# Altium schematic sheet RecoveryBoard_V3.SchDoc
size C; SheetNumber: 1; SheetTotal: 1
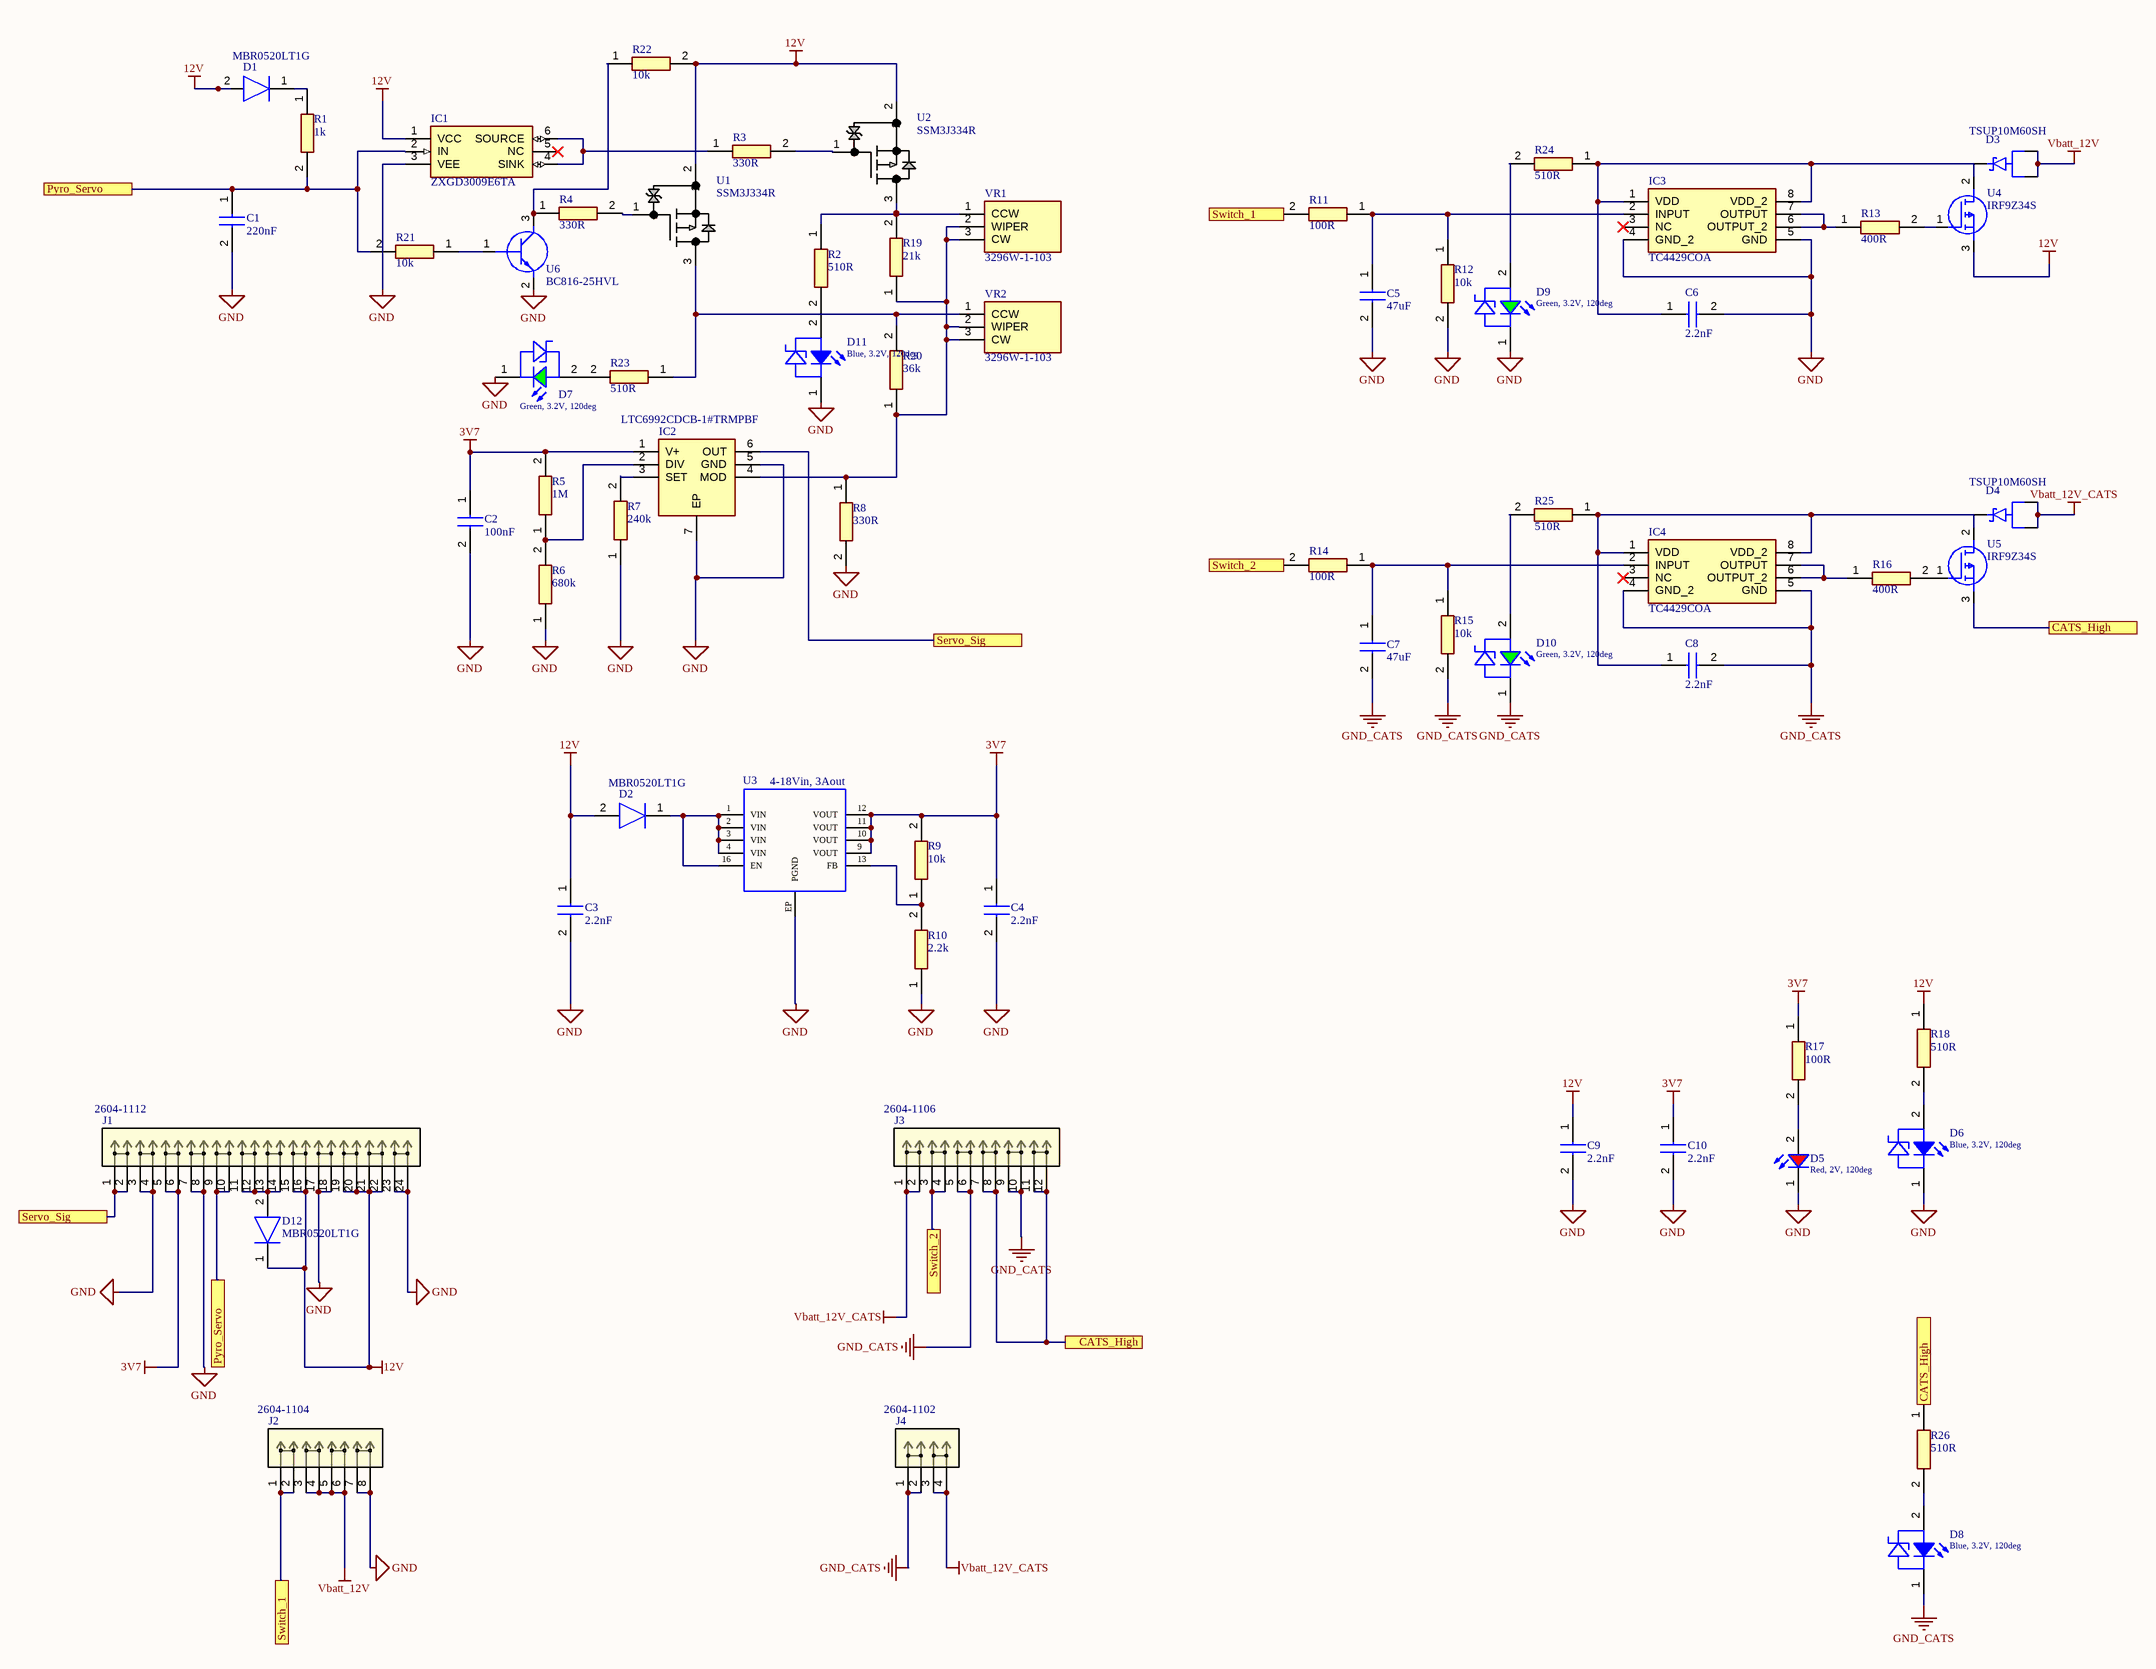
[diagram p0: RecoveryBoard_V3.SchDoc]

## Parts
C1  220nF  [CAPC1608X87N]
C2  100nF  [CAPC1608X87N]
C3  2.2nF  [CAPC1608X87N]
C4  2.2nF  [CAPC1608X87N]
C5  47uF  [CAPC1608X87N]
C6  2.2nF  [CAPC1608X87N]
C7  47uF  [CAPC1608X87N]
C8  2.2nF  [CAPC1608X87N]
C9  2.2nF  [CAPC1608X87N]
C10  2.2nF  [CAPC1608X87N]
D1  MBR0520LT1G  [SOD3716X135N]
D2  MBR0520LT1G  [SOD3716X135N]
D3  TSUP10M60SH  [DIO_TSUP10M60SH]
D4  TSUP10M60SH  [DIO_TSUP10M60SH]
D5  Red, 2V, 120deg  [WL-SMCC_0603_RS_VS_YS]
D6  Blue, 3.2V, 120deg  [WL-SMCC_0603_GS_BS]
D7  Green, 3.2V, 120deg  [WL-SMCC_0603_GS_BS]
D8  Blue, 3.2V, 120deg  [WL-SMCC_0603_GS_BS]
D9  Green, 3.2V, 120deg  [WL-SMCC_0603_GS_BS]
D10  Green, 3.2V, 120deg  [WL-SMCC_0603_GS_BS]
D11  Blue, 3.2V, 120deg  [WL-SMCC_0603_GS_BS]
D12  MBR0520LT1G  [SOD3716X135N]
IC1  ZXGD3009E6TA  [SOT95P285X140-6N]
IC2  LTC6992CDCB-1#TRMPBF  [SON50P300X200X80-7N-D]
IC3  TC4429COA  [SOIC127P600X175-8N]
IC4  TC4429COA  [SOIC127P600X175-8N]
J1  2604-1112  [CONN_2604-1112_24_WAG]
J2  2604-1104  [CONN_2604-1104_8_WAG]
J3  2604-1106  [CONN_2604-1106_12_WAG]
J4  2604-1102  [CONN_2604-1102_4_WAG]
R1  1k  [RESC1608X55N]
R2  510R  [RESC1608X55N]
R3  330R  [RESC1608X55N]
R4  330R  [RESC1608X55N]
R5  1M  [RESC1608X55N]
R6  680k  [RESC1608X55N]
R7  240k  [RESC1608X55N]
R8  330R  [RESC1608X55N]
R9  10k  [RESC1608X55N]
R10  2.2k  [RESC1608X55N]
R11  100R  [RESC1608X55N]
R12  10k  [RESC1608X55N]
R13  400R  [RESC1608X55N]
R14  100R  [RESC1608X55N]
R15  10k  [RESC1608X55N]
R16  400R  [RESC1608X55N]
R17  100R  [RESC1608X55N]
R18  510R  [RESC1608X55N]
R19  21k  [RESC1608X55N]
R20  36k  [RESC1608X55N]
R21  10k  [RESC1608X55N]
R22  10k  [RESC1608X55N]
R23  510R  [RESC1608X55N]
R24  510R  [RESC1608X55N]
R25  510R  [RESC1608X55N]
R26  510R  [RESC1608X55N]
U1  SSM3J334R  [SOT-23F_TOS]
U2  SSM3J334R  [SOT-23F_TOS]
U3  4-18Vin, 3Aout  [LGA-16EP]
U4  IRF9Z34S  [TO-263(D2PAK)]
U5  IRF9Z34S  [TO-263(D2PAK)]
U6  BC816-25HVL  [SOT95P230X110-3N]
VR1  3296W-1-103  [3296W1103]
VR2  3296W-1-103  [3296W1103]

## Ports
CATS_High, Pyro_Servo, Servo_Sig, Switch_1, Switch_2

## Nets
3V7: C2.1 C4.1 C10.1 IC2.1(V+) J1.5 J1.6 R5.2 R9.2 R17.1 U3.9(VOUT) U3.10(VOUT) U3.11(VOUT) U3.12(VOUT)
12V: C3.1 C9.1 D1.2(A) D2.2(A) D12.1(K) IC1.1(VCC) J1.15 J1.16 J1.19 J1.20 J1.21 J1.22 R18.1 R22.2 U1.2 U2.2 U4.3(G)
GND: C1.2 C2.2 C3.2 C4.2 C5.2 C6.2 C9.2 C10.2 D5.1(K) D6.1(K) D7.1(K) D9.1(K) D11.1(K) IC1.3(VEE) IC2.5(GND) IC2.7(EP) IC3.4(GND_2) IC3.5(GND) J1.3 J1.4 J1.7 J1.8 J1.17 J1.18 J1.23 J1.24 J2.7 J2.8 R6.1 R7.1 R8.2 R10.1 R12.2 U3.EP(PGND) U6.2(E)
GND_CATS: C7.2 C8.2 D8.1(K) D10.1(K) IC4.4(GND_2) IC4.5(GND) J3.5 J3.6 J3.9 J3.10 J4.1 J4.2 R15.2
Vbatt_12V: D3.1(A1) D3.2(A2) J2.3 J2.4 J2.5 J2.6
Vbatt_12V_CATS: D4.1(A1) D4.2(A2) J3.1 J3.2 J4.3 J4.4
CATS_High: J3.7 J3.8 J3.11 J3.12 R26.1 U5.3(G) ; port CATS_High
Pyro_Servo: C1.1 IC1.2(IN) J1.9 J1.10 R1.2 R21.2 ; port Pyro_Servo
Servo_Sig: IC2.6(OUT) J1.1 J1.2 ; port Servo_Sig
Switch_1: J2.1 J2.2 R11.2 ; port Switch_1
Switch_2: J3.3 J3.4 R14.2 ; port Switch_2
NetC5_1: C5.1 IC3.2(INPUT) R11.1 R12.1
NetC6_1: C6.1 D3.3(K) IC3.1(VDD) IC3.8(VDD_2) R24.1 U4.2(D)
NetC7_1: C7.1 IC4.2(INPUT) R14.1 R15.1
NetC8_1: C8.1 D4.3(K) IC4.1(VDD) IC4.8(VDD_2) R25.1 U5.2(D)
NetD1_1: D1.1(K) R1.1
NetD2_1: D2.1(K) U3.1(VIN) U3.2(VIN) U3.3(VIN) U3.4(VIN) U3.16(EN)
NetD5_2: D5.2(A) R17.2
NetD6_2: D6.2(A) R18.2
NetD7_2: D7.2(A) R23.2
NetD8_2: D8.2(A) R26.2
NetD9_2: D9.2(A) R24.2
NetD10_2: D10.2(A) R25.2
NetD11_2: D11.2(A) R2.2
NetD12_2: D12.2(A) J1.11 J1.12 J1.13 J1.14
NetIC1_4: IC1.4(SINK) IC1.6(SOURCE) R3.1
NetIC2_2: IC2.2(DIV) R5.1 R6.2
NetIC2_3: IC2.3(SET) R7.2
NetIC2_4: IC2.4(MOD) R8.1 R19.1 R20.1 VR1.2(WIPER) VR1.3(CW) VR2.2(WIPER) VR2.3(CW)
NetIC3_6: IC3.6(OUTPUT_2) IC3.7(OUTPUT) R13.1
NetIC4_6: IC4.6(OUTPUT_2) IC4.7(OUTPUT) R16.1
NetR2_1: R2.1 R19.2 U2.3 VR1.1(CCW)
NetR3_2: R3.2 U2.1
NetR4_1: R4.1 R22.1 U6.3(C)
NetR4_2: R4.2 U1.1
NetR9_1: R9.1 R10.2 U3.13(FB)
NetR13_2: R13.2 U4.1(G)
NetR16_2: R16.2 U5.1(G)
NetR20_2: R20.2 R23.1 U1.3 VR2.1(CCW)
NetR21_1: R21.1 U6.1(B)

Not connected (* = marked no-connect by the designer): IC1 5(NC)*; IC3 3(NC)*; IC4 3(NC)*

## Notes on the sheet
- DWG. NO.
- REV.
- SHT.
- THIS DOCUMENT AND THE DATA DISCLOSED HEREIN OR HEREWITH IS THE PROPERTY OF ALTIUM LIMITED AND MAY BE FREELY DISTRIBUTED IN WHOLE. NO RIGHTS ARE RESERVED OR EXPRESS OR IMPLIED WARANTEE GIVEN.
- REVISION
- DESCRIPTION
- DATE
- APPROVED
- ENG:
- APPROVALS
- PROJECT
- DSN:
- CHK:
- REFERENCE DOCUMENTS
- PROJECT REVISION:
- TITLE
- DOCUMENT REVISION:
- DESIGN ITEM:
- BOM:
- FAB DWG:
- PCB DWG:
- ASSY DWG:
- SCALE:
- SIZE
- B
- CAGE CODE
- FILE NAME
- DWG NO.
- SHEET
- OF
- REV

## Library data of the parts
C1-C10 = 885012206036: Capacitor; Manufacturer_Name: Wurth Elektronik; Datasheet Link: https://katalog.we-online.com/pbs/datasheet/885012206036.pdf; Height: 0.87mm; Manufacturer_Part_Number: 885012206036
D1 D2 D12 = MBR0520LT1G: Diode; Manufacturer_Name: ON Semiconductor; Datasheet Link: http://www.onsemi.com/pub/Collateral/MBR0520LT1-D.PDF; Height: 1.35mm; Manufacturer_Part_Number: MBR0520LT1G
D5 = 150060RS73220: WL-SMCC SMD Mono-color Chip LED Compact, size 0603, Red, 2V, 120deg; Dominant Wavelength: 624nm; Luminous Intensity: 90mcd; Peak Wavelength: 632nm; Chip Technology: AlInGaP; ComponentLink1URL: http://www.we-online.de; ComponentLink2Description: Datasheet; ComponentLink2URL: https://katalog.we-online.com/led/datasheet/150060RS73220.pdf; Part Number: 150060RS73220; Published Date: July 2019; Publisher: Wurth Elektronik; Size: 0603; Viewing Angle: 120deg; Packaging: Tape and Reel; Emitting Color: Red; Mounting Technology: SMT; Forward Voltage: 2V; Operating Temperature: -40 to +85degC
D6 D8 D11 = 150060BS73220: WL-SMCC SMD Mono-color Chip LED Compact, size 0603, Blue, 3.2V, 120deg; Dominant Wavelength: 470nm; Luminous Intensity: 170mcd; Peak Wavelength: 465nm; Chip Technology: InGaN; ComponentLink1URL: http://www.we-online.de; ComponentLink2Description: Datasheet; ComponentLink2URL: https://katalog.we-online.com/led/datasheet/150060BS73220.pdf; Part Number: 150060BS73220; Published Date: July 2019; Publisher: Wurth Elektronik; Size: 0603; Viewing Angle: 120deg; Packaging: Tape and Reel; Emitting Color: Blue; Mounting Technology: SMT; Forward Voltage: 3.2V; Operating Temperature: -40 to +85degC
D7 D9 D10 = 150060GS73220: WL-SMCC SMD Mono-color Chip LED Compact, size 0603, Green, 3.2V, 120deg; Dominant Wavelength: 525nm; Luminous Intensity: 700mcd; Peak Wavelength: 520nm; Chip Technology: InGaN; ComponentLink1URL: http://www.we-online.de; ComponentLink2Description: Datasheet; ComponentLink2URL: https://katalog.we-online.com/led/datasheet/150060GS73220.pdf; Part Number: 150060GS73220; Published Date: July 2019; Publisher: Wurth Elektronik; Size: 0603; Viewing Angle: 120deg; Packaging: Tape and Reel; Emitting Color: Green; Mounting Technology: SMT; Forward Voltage: 3.2V; Operating Temperature: -40 to +85degC
IC1 = ZXGD3009E6TA: Integrated Circuit; Manufacturer_Name: Diodes Inc.; Datasheet Link: https://componentsearchengine.com//ZXGD3009E6TA.pdf; Height: 1.4mm; Mouser2 Part Number: 621-ZXGD3009E6TA; Mouser2 Price/Stock: https://www.mouser.com/Search/Refine.aspx?Keyword=621-ZXGD3009E6TA; Manufacturer_Part_Number: ZXGD3009E6TA
IC2 = LTC6992CDCB-1#TRMPBF: Integrated Circuit; Manufacturer_Name: Linear Technology; Datasheet Link: http://cds.linear.com/docs/en/datasheet/69921234fc.pdf; Height: 0.8mm; Manufacturer_Part_Number: LTC6992CDCB-1#TRMPBF
IC3 IC4 = TC4429COA: Integrated Circuit; Manufacturer_Name: Microchip; Datasheet Link: https://componentsearchengine.com//TC4429COA.pdf; Mouser2 Part Number: 579-TC4429COA; Mouser2 Price/Stock: https://www.mouser.com/Search/Refine.aspx?Keyword=579-TC4429COA; Manufacturer_Part_Number: TC4429COA
J1 = 2604-1112: No Description Available; Mfr_Name: Wago; Copyright: Copyright (C) 2022 Ultra Librarian. All rights reserved.; Manufacturer_Part_Number: 2604-1112; RefDes: RefDes; Type: DEV
J2 = 2604-1104: No Description Available; Mfr_Name: Wago; Copyright: Copyright (C) 2022 Ultra Librarian. All rights reserved.; Manufacturer_Part_Number: 2604-1104; RefDes: RefDes; Type: DEV
J3 = 2604-1106: No Description Available; Mfr_Name: Wago; Copyright: Copyright (C) 2022 Ultra Librarian. All rights reserved.; Manufacturer_Part_Number: 2604-1106; RefDes: RefDes; Type: DEV
J4 = 2604-1102: No Description Available; Mfr_Name: Wago; Copyright: Copyright (C) 2022 Ultra Librarian. All rights reserved.; Manufacturer_Part_Number: 2604-1102; RefDes: RefDes; Type: DEV
R1-R26 = SDR03EZPF1003: Resistor; Manufacturer_Name: ROHM Semiconductor; Datasheet Link: https://fscdn.rohm.com/en/products/databook/datasheet/passive/resistor/chip_resistor/sdr-e.pdf; Height: 0.55mm; Manufacturer_Part_Number: SDR03EZPF1003
U1 U2 = SSM3J334R: No Description Available; Mfr_Name: Toshiba Electronic Devices & Storage Co.; Copyright: Copyright (C) 2022 Ultra Librarian. All rights reserved.; Manufacturer_Part_Number: SSM3J334R; Digi-Key_Part_Number_1: SSM3J334RLFCT-ND; Digi-Key_Part_Number_2: SSM3J334RLFDKR-ND; Digi-Key_Part_Number_3: SSM3J334RLFTR-ND; RefDes: RefDes; Type: DEV
U3 = 171031801: MagI3C-VDRM Variable Step Down Regulator Module, LGA-16EP, 4-18Vin, 3Aout; Manufacturer: Wurth Elektronik; Input Voltage: 4-18V; Output Current: 3A; Output Voltage: 0.8-17V; ComponentLink1Description: Manufacturer; ComponentLink1URL: http://www.we-online.de; ComponentLink2Description: Datasheet; ComponentLink2URL: https://katalog.we-online.de/pm/datasheet/171031801.pdf; Mounting Technology: SMT; Operating Temperature: -40 to +125degC; Manufacturer Part Number: 171031801; Packaging: Tape and Reel; Published Date: April 2020; Size: LGA-16EP
U4 U5 = IRF9Z34S: MOSFET (P-Channel); Manufacturer_Name: Vishay; Datasheet Link: https://www.vishay.com/docs/91093/sihf9z34.pdf; Manufacturer_Part_Number: IRF9Z34S; Mouser Part Number: 844-IRF9Z34S; Mouser Price/Stock: https://www.mouser.co.uk/ProductDetail/Vishay-Siliconix/IRF9Z34S?qs=ehM%252BESVsXgyORxAgBh%252BlaA%3D%3D
U6 = BC816-25HVL: Transistor BJT NPN; Manufacturer_Name: Nexperia; Height: 1.1mm; Manufacturer_Part_Number: BC816-25HVL
VR1 VR2 = 3296W-1-103: Variable Resistor; Manufacturer_Name: Bourns; Datasheet Link: https://www.bourns.com/data/global/pdfs/3296.pdf; Height: 11.8mm; Manufacturer_Part_Number: 3296W-1-103; Mouser Part Number: 652-3296W-1-103; Mouser Price/Stock: https://www.mouser.co.uk/ProductDetail/Bourns/3296W-1-103?qs=T%252BU9C%252B7w6dI0ejYuMqy4%2FQ%3D%3D; Arrow Part Number: 3296W-1-103; Arrow Price/Stock: https://www.arrow.com/en/products/3296w-1-103/bourns
D3 D4 = TSUP10M60SH: Price: None; Value: *; Package: None; Availability: Unavailable; MP: TSUP10M60SH